# EAGLE design 3DoT-Hexy-Shield (EAGLE 9.3.1)
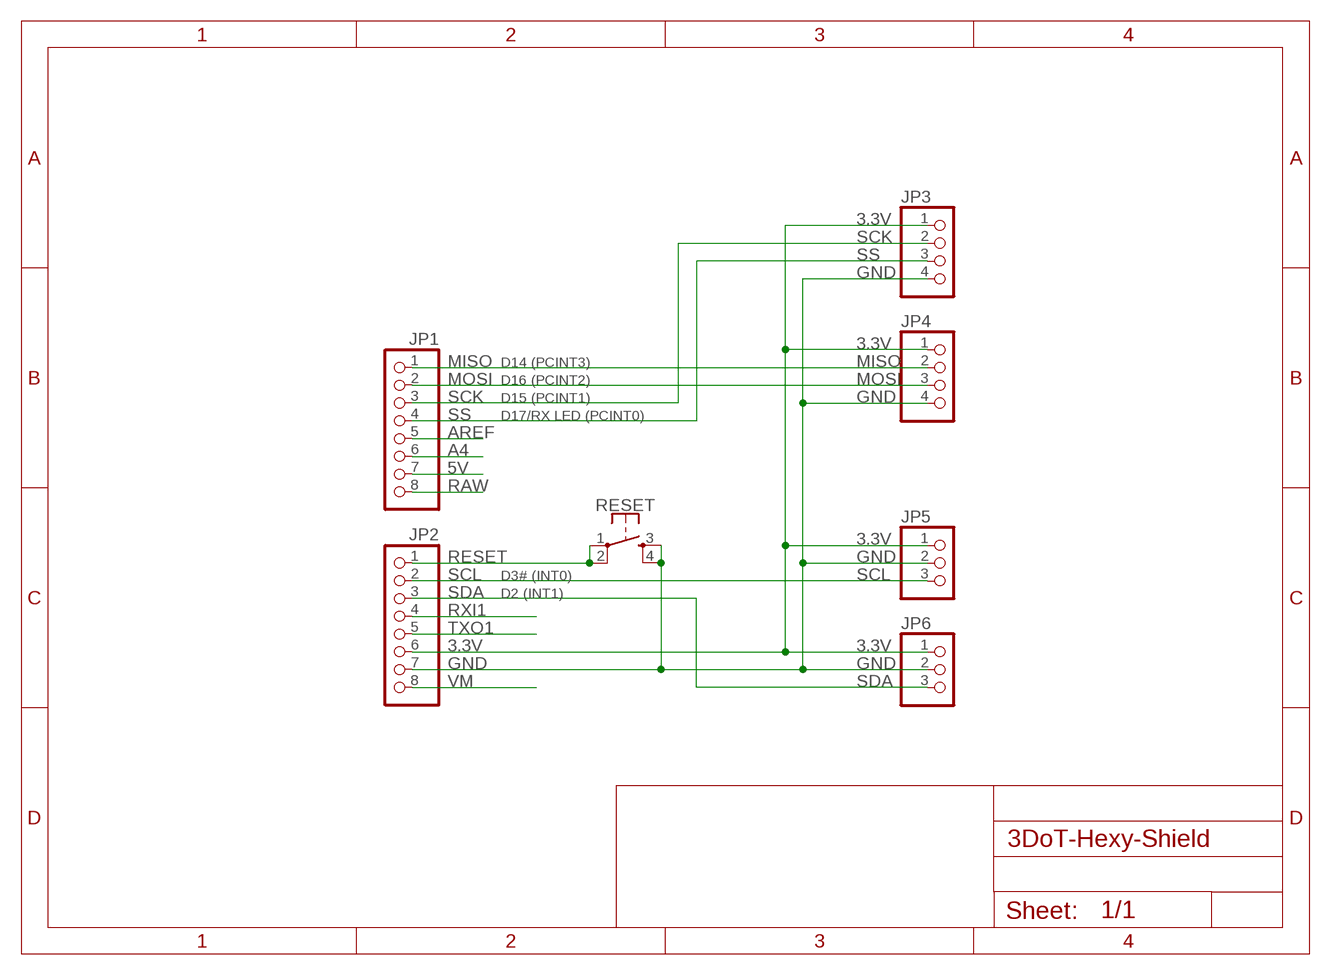
[diagram p0: schematic, sheet 1]

## Parts
JP1  PINHD-1X8  [1X08]
JP2  PINHD-1X8  [1X08]
JP3  PINHD-1X4  [1X04]
JP4  PINHD-1X4  [1X04]
JP5  PINHD-1X3  [1X03]
JP6  PINHD-1X3  [1X03]
RESET  MOMENTARY-SWITCH-SPST-2-SMD-5.2MM  [TACTILE_SWITCH_SMD_5.2MM]

## Nets
3.3V: JP2.6 JP3.1 JP4.1 JP5.1 JP6.1
5V: JP1.7
A4: JP1.6
AREF: JP1.5
GND: JP2.7 JP3.4 JP4.4 JP5.2 JP6.2 RESET.3 RESET.4
MISO: JP1.1 JP4.2
MOSI: JP1.2 JP4.3
RAW: JP1.8
RESET: JP2.1 RESET.1 RESET.2
RXI1: JP2.4
SCK: JP1.3 JP3.2
SCL: JP2.2 JP5.3
SDA: JP2.3 JP6.3
SS: JP1.4 JP3.3
TXO1: JP2.5
VM: JP2.8

## Notes on the sheet
- D14 (PCINT3)
- D16 (PCINT2)
- D15 (PCINT1)
- D17/RX LED (PCINT0)
- D3# (INT0)
- D2 (INT1)

## Library data of the parts
JP1 JP2 = pinhead:PINHD-1X8: PIN HEADER
JP3 JP4 = pinhead:PINHD-1X4: PIN HEADER
JP5 JP6 = pinhead:PINHD-1X3: PIN HEADER
RESET = SparkFun-Switches:MOMENTARY-SWITCH-SPST-2: Momentary Switch (Pushbutton) - SPST - Two Circuits Normally-open (NO) SPST momentary switches (buttons, pushbuttons). Schematic symbol includes two switch circuits. Variants SMD-4.6MMX2.8MM - 4.60mm x 2.80mm Tactile Momentary Button Switch - Used on SparkFun SAMD21 Mini Breakout <https://www.sparkfun.com/products/13664> SMD-5.2MM - Mini Pushbutton Switch - SMD <https://www.sparkfun.com/products/8720> - Used on Arduino Pro Mini <https://www.sparkfun.com/products/11114>; PROD_ID: SWCH-08247; SF_SKU: COM-08720

## Board
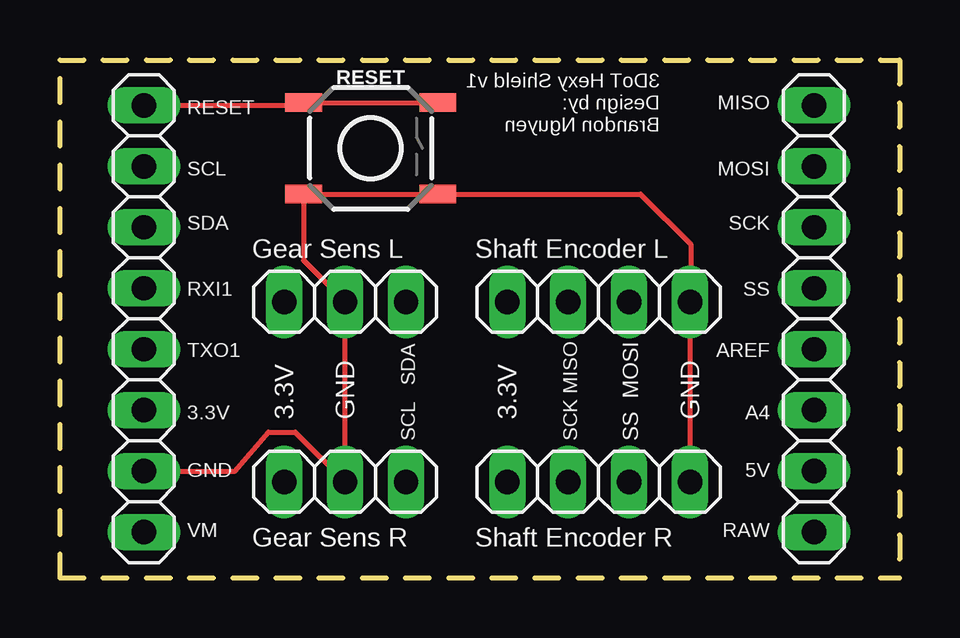
[diagram p1: board, top side]
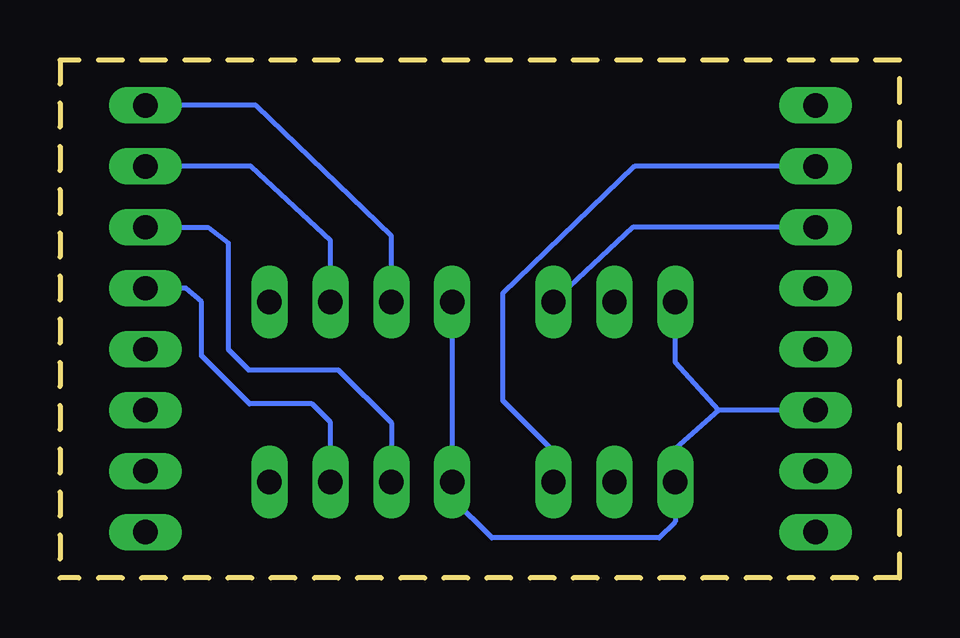
[diagram p2: board, bottom side, seen from below]

Size 35 x 21.58 mm. Coordinates in mm from the lower left corner, seen from the top.
Outline: 0,0 0,21.58 35,21.58 35,0 0,0
Copper layers (1*16): Top 0.035mm / dielectric 1.5mm / Bottom 0.035mm
Design rules "default": minimum track width 6mil, minimum drill 0.35mm, track to track 6mil, track to pad 6mil, pad to pad 6mil, via to via 6mil, smd to smd 6mil, copper to edge 40mil, drill to drill 6mil, minimum pad ring 10mil, minimum via ring 8mil, stop-mask expansion 4mil, vias tented up to drill 0mil, thermal gap 10mil

### Footprints (pad centres in the part's own frame; a part is rotated, then mirrored left to right if it is on the bottom)
1X08 = drill 1.016 long: 1 -8.89,0; 2 -6.35,0; 3 -3.81,0; 4 -1.27,0; 5 1.27,0; 6 3.81,0; 7 6.35,0; 8 8.89,0
1X04 = drill 1.016 long: 1 -3.81,0; 2 -1.27,0; 3 1.27,0; 4 3.81,0
1X03 = drill 1.016 long: 1 -2.54,0; 2 0,0; 3 2.54,0
TACTILE_SWITCH_SMD_5.2MM = smd 1.524 x 0.762: 1 -2.794,1.905; 2 2.794,1.905; 3 -2.794,-1.905; 4 2.794,-1.905

### Placement (x,y rotation side)
JP1  31.43,10.8 270 top
JP2  3.49,10.8 270 top
JP3  22.46,4 0 top
JP4  22.46,11.5 0 top
JP5  11.89,4 0 top
JP6  11.89,11.5 0 top
RESET  12.95,17.9 0 top

### Tracks (layer width: path | path; a pad name or v marks a point on that pad's centre or on a via)
3.3V
  Bottom 0.2: JP2.6 7.54,6.99 | JP6.1 9.35,9 7.54,6.99 | 7.54,6.99 9.35,5.38 JP5.1 9.35,2.35 10.03,1.67 17,1.67 18.65,3.31 JP3.1 JP4.1
GND
  Top 0.2: JP2.7 7.31,4.45 8.69,6.08 9.81,6.08 JP5.2 JP6.2 10.16,13.23 RESET.3 RESET.4 24.2,15.99 26.3,13.9 26.3,11.53 JP4.4 JP3.4
MISO
  Bottom 0.2: JP4.2 21.19,14.25 26.83,19.69 JP1.1
MOSI
  Bottom 0.2: JP4.3 23.73,14.06 27.03,17.15 JP1.2
RESET
  Top 0.2: JP2.1 10.16,19.69 RESET.1 RESET.2
SCK
  Bottom 0.2: JP3.2 21.19,6.46 23.4,8.67 27.14,8.67 27.98,9.52 27.98,13.96 28.83,14.61 JP1.3
SCL
  Bottom 0.2: JP2.2 11.05,17.15 16.55,11.85 16.55,7.4 14.43,5.28 JP5.3
SDA
  Bottom 0.2: JP2.3 11.12,14.61 JP6.3
SS
  Bottom 0.2: JP3.3 23.73,6.48 24.5,7.25 27.1,7.25 29.1,9.25 29.1,11.5 29.75,12.07 JP1.4

### Text on the board
tPlace: Gear Sens L | Shaft Encoder L | Gear Sens R | Shaft Encoder R
tNames: MISO | RESET | 3DoT Hexy Shield v1 / Design by: / Brandon Nguyen | SCL | MOSI | SDA | SCK | RXI1 | SS | TXO1 | AREF | 3.3V | 3.3V | GND | 3.3V | GND | A4 | SCL SDA | SCK MISO | SS MOSI | GND | 5V | VM | RAW